# EAGLE design Massage_Pad_Main (EAGLE 9.3.1)
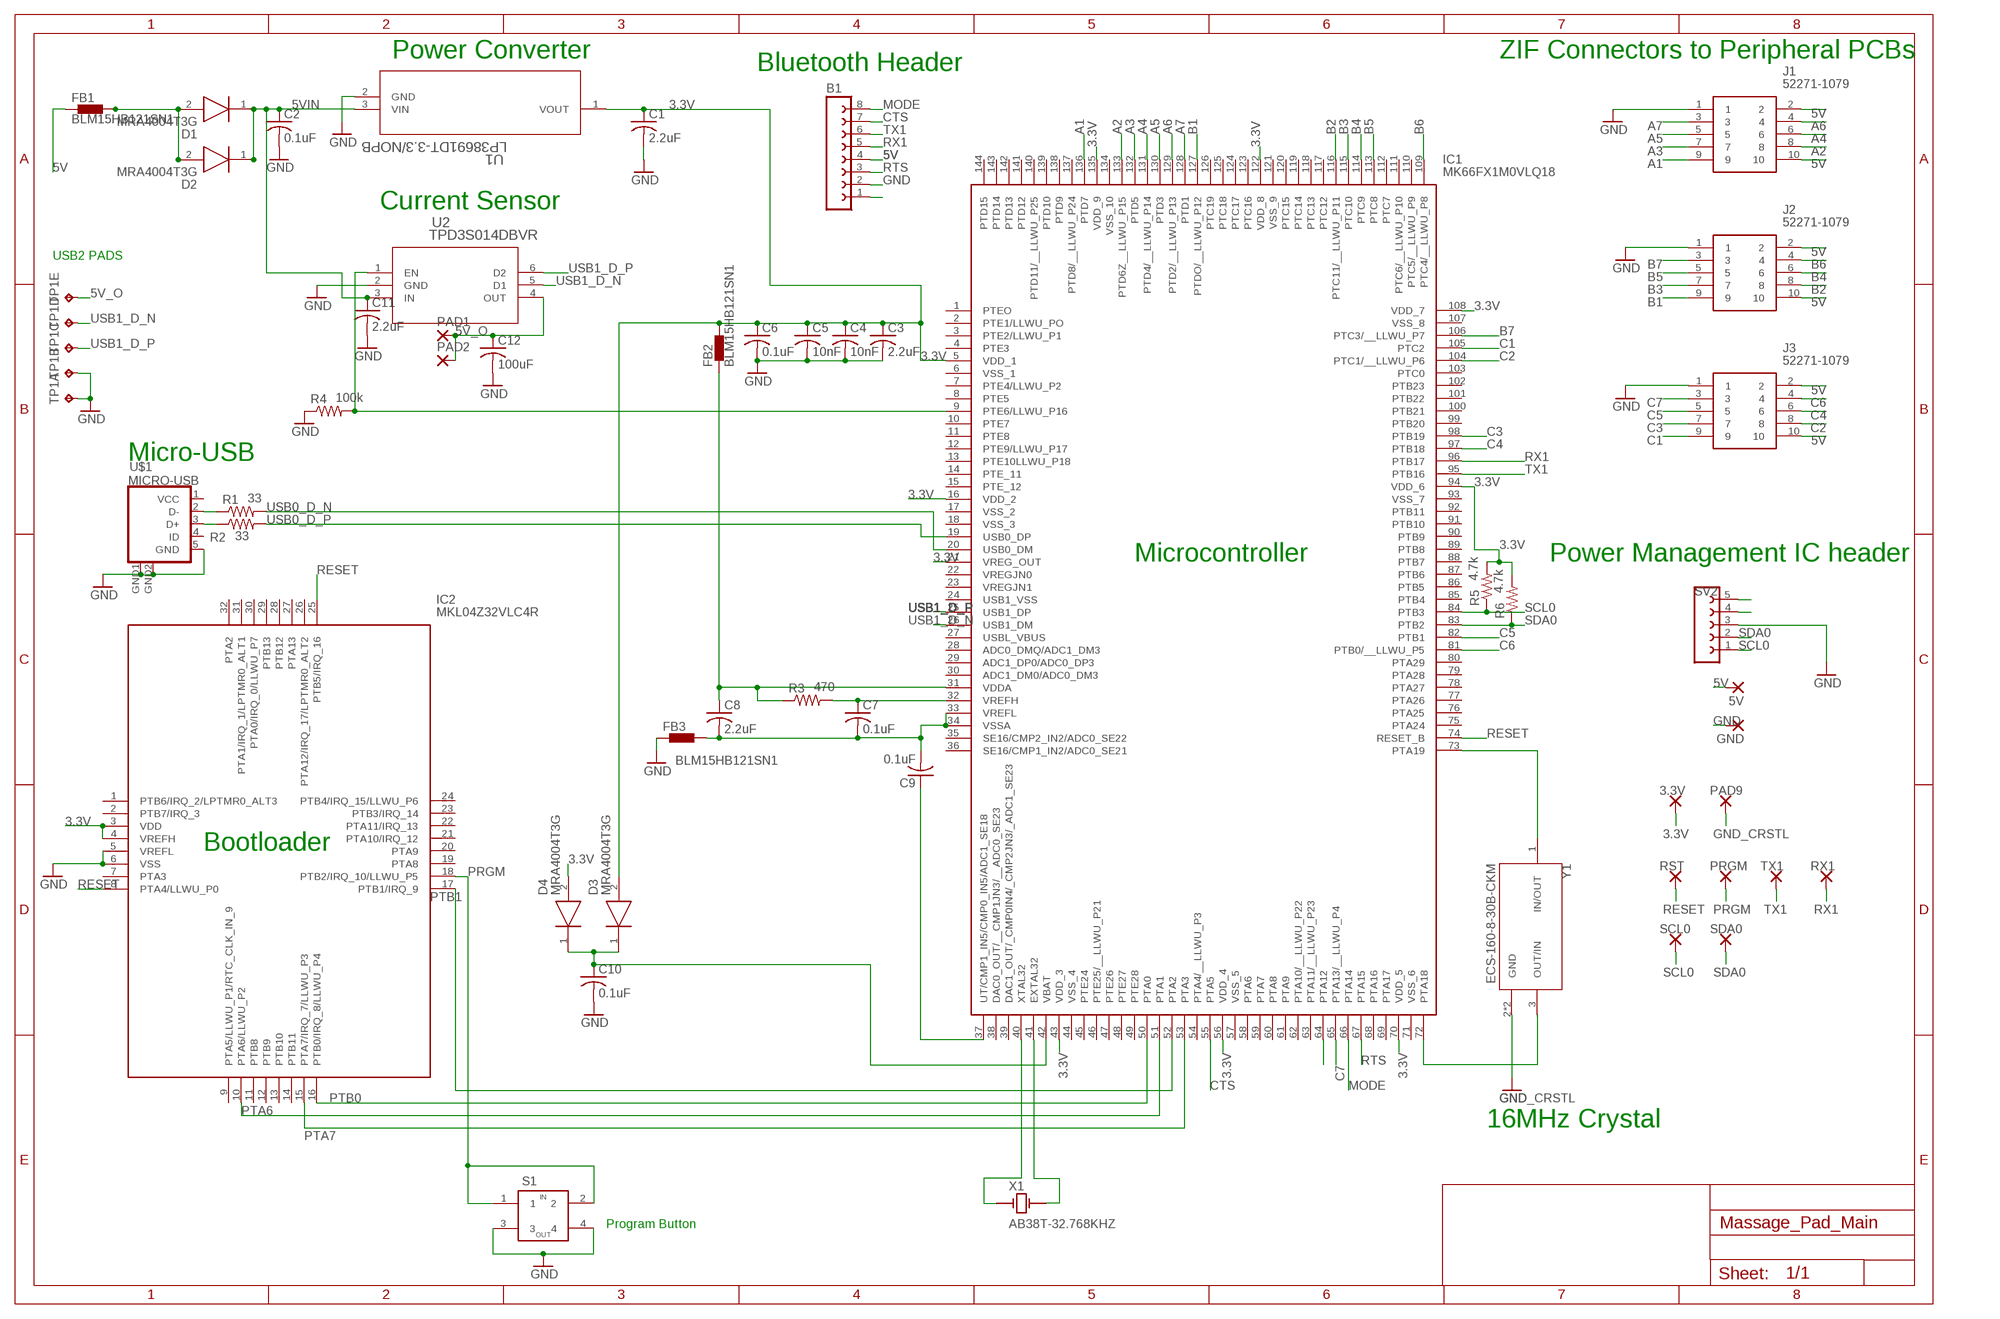
[diagram p0: schematic, sheet 1]

## Parts
3.3V  1,6/0,8  [1,6/0,8]
5V  3,17/1,3  [3,17/1,3]
B1  BT-BLE-2479  [BT-BLE-2479]
C1  2.2uF  C-USC1812K  [C1812K]
C2  0.1uF  C-USC1808  [C1808]
C3  2.2uF  C-USC1812K  [C1812K]
C4  10nF  C-USC1808  [C1808]
C5  10nF  C-USC1808  [C1808]
C6  0.1uF  C-USC1808  [C1808]
C7  0.1uF  C-USC1808  [C1808]
C8  2.2uF  C-USC1812K  [C1812K]
C9  0.1uF  C-USC1808  [C1808]
C10  0.1uF  C-USC1808  [C1808]
C11  2.2uF  C-USC1812K  [C1812K]
C12  100uF  C-USC1210K  [C1210K]
D1  MRA4004T3G  [DIOM5226X220N]
D2  MRA4004T3G  [DIOM5226X220N]
D3  MRA4004T3G  [DIOM5226X220N]
D4  MRA4004T3G  [DIOM5226X220N]
FB1  BLM15HB121SN1  [0402]
FB2  BLM15HB121SN1  [0402]
FB3  BLM15HB121SN1  [0402]
GND  3,17/1,3  [3,17/1,3]
IC1  MK66FX1M0VLQ18  [QFP50P2200X2200X160-144N]
IC2  MKL04Z32VLC4R  [QFP80P900X900X160-32N]
J1  52271-1079  [52271-1079]
J2  52271-1079  [52271-1079]
J3  52271-1079  [52271-1079]
PAD1  SMD5  [SMD2,54-5,08]
PAD2  SMD5  [SMD2,54-5,08]
PAD9  1,6/0,8  [1,6/0,8]
PRGM  1,6/0,8  [1,6/0,8]
R1  33  R-US_R1206  [R1206]
R2  33  R-US_R1206  [R1206]
R3  470  R-US_R1206  [R1206]
R4  100k  R-US_R1206  [R1206]
R5  4.7k  R-US_R1206  [R1206]
R6  4.7k  R-US_R1206  [R1206]
RST  1,6/0,8  [1,6/0,8]
RX1  1,6/0,8  [1,6/0,8]
S1  RS-187R05A2-DSMTRT  [RS-187R05A2-DSMTRT]
SCL0  1,6/0,8  [1,6/0,8]
SDA0  1,6/0,8  [1,6/0,8]
SV2  FE05-1  [FE05-1]
TP1  TP5P5-25-13  [P5-25-13]
TX1  1,6/0,8  [1,6/0,8]
U1  LP38691DT-3.3/NOPB  [TD03B]
U2  TPD3S014DBVR  [DBV6]
U$1  MICRO-USB  [MICRO-USB]
X1  AB38T-32.768KHZ  [XTAL_AB38T-32.768KHZ]
Y1  ECS-160-8-30B-CKM  [XTAL_ECS-160-8-30B-CKM]

## Nets
3.3V: 3.3V.1(P) C1.1 C3.1 C4.1 C5.1 C6.1 D3.2(A) D4.2(A) FB2.2 IC1.5(VDD_1) IC1.16(VDD_2) IC1.21(VREG_OUT) IC1.43(VDD_3) IC1.56(VDD_4) IC1.70(VDD_5) IC1.94(VDD_6) IC1.108(VDD_7) IC1.122(VDD_8) IC1.135(VDD_9) IC2.3(VDD) IC2.4(VREFH) R5.2 R6.2 U1.1(VOUT)
5V: 5V.1(P) B1.4 FB1.1 J1.2 J1.10 J2.2 J2.10 J3.2 J3.10
5V_O: C12.1 PAD1.1(P) PAD2.1(P) TP1.TP-5 U2.4(OUT)
5VIN: C2.1 C11.1 D1.1(K) D2.1(K) U1.3(VIN) U2.3(IN)
A1: IC1.136(PTD7) J1.9
A2: IC1.133(PTD6Z__LLWU_P15) J1.8
A3: IC1.132(PTD5) J1.7
A4: IC1.131(PTD4/__LLWU_P14) J1.6
A5: IC1.130(PTD3) J1.5
A6: IC1.129(PTD2/__LLWU_P13) J1.4
A7: IC1.128(PTD1) J1.3
B1: IC1.127(PTDO/__LLWU_P12) J2.9
B2: IC1.116(PTC11/__LLWU_P11) J2.8
B3: IC1.115(PTC10) J2.7
B4: IC1.114(PTC9) J2.6
B5: IC1.113(PTC8) J2.5
B6: IC1.109(PTC4/__LLWU_P8) J2.4
B7: IC1.106(PTC3/__LLWU_P7) J2.3
C1: IC1.105(PTC2) J3.9
C2: IC1.104(PTC1/__LLWU_P6) J3.8
C3: IC1.98(PTB19) J3.7
C4: IC1.97(PTB18) J3.6
C5: IC1.82(PTB1) J3.5
C6: IC1.81(PTB0/__LLWU_P5) J3.4
C7: IC1.65(PTA13/__LLWU_P4) J3.3
CTS: B1.7 IC1.55(PTA5)
DFU_5V: B1.1
GND: B1.2 C1.2 C2.2 C3.2 C4.2 C5.2 C6.2 C10.2 C11.2 C12.2 FB3.1 GND.1(P) IC2.5(VREFL) IC2.6(VSS) J1.1 J2.1 J3.1 R4.1 S1.3 S1.4 SV2.3 TP1.TP-1 TP1.TP-2 U1.2(GND) U2.2(GND) U$1.5(GND) U$1.GND1(GND) U$1.GND2(GND)
GND_CRSTL: PAD9.1(P) Y1.2(GND) Y1.4(GND) ; supply symbol labelled GND
MODE: B1.8 IC1.66(PTA14)
N$5: C10.1 D3.1(K) D4.1(K) IC1.42(VBAT)
N$8 [usb diff]: R1.1 U$1.2(D-)
N$10 [usb diff]: R2.1 U$1.3(D+)
N$21: D1.2(A) D2.2(A) FB1.2
N$22: IC1.64(PTA12)
N$23: IC1.73(PTA19) Y1.1(IN/OUT)
N$24: C7.1 IC1.32(VREFH) R3.2
N$26: C7.2 C8.2 C9.2 FB3.2 IC1.33(VREFL) IC1.34(VSSA)
N$27: C8.1 FB2.1 IC1.31(VDDA) R3.1
N$28: C9.1 IC1.37(UT/CMP1_IN5/CMP0_IN5/ADC1_SE18)
N$29: IC1.72(PTA18) Y1.3(OUT/IN)
N$30: IC1.40(XTAL32) X1.1
N$31: IC1.41(EXTAL32) X1.2
N$32: SV2.5
N$33: SV2.4
N$34: IC1.9(PTE6/LLWU_P16) R4.2 U2.1(EN)
PRGM: IC2.18(PTB2/IRQ_10/LLWU_P5) PRGM.1(P) S1.1 S1.2
PTA6: IC1.51(PTA1) IC2.10(PTA6/LLWU_P2)
PTA7: IC1.53(PTA3) IC2.15(PTA7/IRQ_7/LLWU_P3)
PTB0: IC1.50(PTA0) IC2.16(PTB0/IRQ_8/LLWU_P4)
PTB1: IC1.52(PTA2) IC2.17(PTB1/IRQ_9)
RESET: IC1.74(RESET_B) IC2.8(PTA4/LLWU_P0) IC2.25(PTB5/IRQ_16) RST.1(P)
RTS: B1.3 IC1.67(PTA15)
RX1: B1.5 IC1.96(PTB17) RX1.1(P)
SCL0: IC1.84(PTB3) R5.1 SCL0.1(P) SV2.1
SDA0: IC1.83(PTB2) R6.1 SDA0.1(P) SV2.2
TX1: B1.6 IC1.95(PTB16) TX1.1(P)
USB0_D_N [usb diff]: IC1.20(USB0_DM) R1.2
USB0_D_P [usb diff]: IC1.19(USB0_DP) R2.2
USB1_D_N [usb diff]: IC1.26(USB1_DM) TP1.TP-4 U2.5(D1)
USB1_D_P [usb diff]: IC1.25(USB1_DP) TP1.TP-3 U2.6(D2)
Unconnected: IC1.1(PTEO) IC1.2(PTE1/LLWU_PO) IC1.3(PTE2/LLWU_P1) IC1.4(PTE3) IC1.6(VSS_1) IC1.7(PTE4/LLWU_P2) IC1.8(PTE5) IC1.10(PTE7) IC1.11(PTE8) IC1.12(PTE9/LLWU_P17) IC1.13(PTE10LLWU_P18) IC1.14(PTE_11) IC1.15(PTE_12) IC1.17(VSS_2) IC1.18(VSS_3) IC1.22(VREGJN0) IC1.23(VREGJN1) IC1.24(USB1_VSS) IC1.27(USBL_VBUS) IC1.28(ADC0_DMQ/ADC1_DM3) IC1.29(ADC1_DP0/ADC0_DP3) IC1.30(ADC1_DM0/ADC0_DM3) IC1.35(SE16/CMP2_IN2/ADC0_SE22) IC1.36(SE16/CMP1_IN2/ADC0_SE21) IC1.38(DAC0_OUT/__CMP1JN3/__ADC0_SE23) IC1.39(DAC1_OUT/_CMP0IN4/_CMP2JN3/_ADC1_SE23) IC1.44(VSS_4) IC1.45(PTE24) IC1.46(PTE25/__LLWU_P21) IC1.47(PTE26) IC1.48(PTE27) IC1.49(PTE28) IC1.54(PTA4/__LLWU_P3) IC1.57(VSS_5) IC1.58(PTA6) IC1.59(PTA7) IC1.60(PTA8) IC1.61(PTA9) IC1.62(PTA10/__LLWU_P22) IC1.63(PTA11/__LLWU_P23) IC1.68(PTA16) IC1.69(PTA17) IC1.71(VSS_6) IC1.75(PTA24) IC1.76(PTA25) IC1.77(PTA26) IC1.78(PTA27) IC1.79(PTA28) IC1.80(PTA29) IC1.85(PTB4) IC1.86(PTB5) IC1.87(PTB6) IC1.88(PTB7) IC1.89(PTB8) IC1.90(PTB9) IC1.91(PTB10) IC1.92(PTB11) IC1.93(VSS_7) IC1.99(PTB20) IC1.100(PTB21) IC1.101(PTB22) IC1.102(PTB23) IC1.103(PTC0) IC1.107(VSS_8) IC1.110(PTC5/__LLWU_P9) IC1.111(PTC6/__LLWU_P10) IC1.112(PTC7) IC1.117(PTC12) IC1.118(PTC13) IC1.119(PTC14) IC1.120(PTC15) IC1.121(VSS_9) IC1.123(PTC16) IC1.124(PTC17) IC1.125(PTC18) IC1.126(PTC19) IC1.134(VSS_10) IC1.137(PTD8/__LLWU_P24) IC1.138(PTD9) IC1.139(PTD10) IC1.140(PTD11/__LLWU_P25) IC1.141(PTD12) IC1.142(PTD13) IC1.143(PTD14) IC1.144(PTD15) IC2.1(PTB6/IRQ_2/LPTMR0_ALT3) IC2.2(PTB7/IRQ_3) IC2.7(PTA3) IC2.9(PTA5/LLWU_P1/RTC_CLK_IN_9) IC2.11(PTB8) IC2.12(PTB9) IC2.13(PTB10) IC2.14(PTB11) IC2.19(PTA8) IC2.20(PTA9) IC2.21(PTA10/IRQ_12) IC2.22(PTA11/IRQ_13) IC2.23(PTB3/IRQ_14) IC2.24(PTB4/IRQ_15/LLWU_P6) IC2.26(PTA12/IRQ_17/LPTMR0_ALT2) IC2.27(PTA13) IC2.28(PTB12) IC2.29(PTB13) IC2.30(PTA0/IRQ_0/LLWU_P7) IC2.31(PTA1/IRQ_1/LPTMR0_ALT1) IC2.32(PTA2) U$1.4(ID)

## Notes on the sheet
- Power Converter | ZIF Connectors to Peripheral PCBs
- Bluetooth Header
- Current Sensor
- USB2 PADS
- Micro-USB
- Microcontroller | Power Management IC header
- Bootloader
- 16MHz Crystal
- Program Button

## Power pins joined to a net without a drawn wire
VCC: U$1.1(VCC)

## Library data of the parts
3.3V PAD9 PRGM RST RX1 SCL0 SDA0 TX1 = wirepad:1,6/0,8: THROUGH-HOLE PAD
5V GND = wirepad:3,17/1,3: THROUGH-HOLE PAD
B1 = altair_mainPCB_custom_lib:BT-BLE-2479: Adafruit bluetooth BLE module for mounting onto PCB. Has female headers for mating with the BLE board.
C1-C12 = rcl:C-US: CAPACITOR, American symbol; SPICEPREFIX: C
D1-D4 = MRA4004T3G:MRA4004T3G: Rectifier diode,MRA4004 1A 400V ON Semi MRA4004T3G, SMT Switching Diode, 400V 1A, 2-Pin DO-214AC Source: Datasheet <http://www.onsemi.com/pub/Collateral/MRA4003T3-D.PDF>; ALLIED_NUMBER: 70340468; ALLIED_PRICE-STOCK: http://www.alliedelec.com/on-semiconductor-mra4004t3g/70340468/; DESCRIPTION: Rectifier diode,MRA4004 1A 400V ON Semi MRA4004T3G, SMT Switching Diode, 400V 1A, 2-Pin DO-214AC; HEIGHT: 2.2mm; MANUFACTURER_NAME: ON Semiconductor; MANUFACTURER_PART_NUMBER: MRA4004T3G; MOUSER_PART_NUMBER: 863-MRA4004T3G; MOUSER_PRICE-STOCK: https://www.mouser.com/Search/Refine.aspx?Keyword=863-MRA4004T3G; RS_PART_NUMBER: 6490904; RS_PRICE-STOCK: http://uk.rs-online.com/web/p/products/6490904
FB1-FB3 = inductors:BLM15H: EMIFIL (R) Chip Ferrite Bead for GHz Noise Source: http://www.murata.com/ Ferrite Bead BLM15H.pdf
IC1 = MK66FX1M0VLQ18:MK66FX1M0VLQ18: NXP - MK66FX1M0VLQ18 - MPU, ARM CORTEX-M4F, 180MHZ, LQFP-144 Source: Datasheet <https://cache.nxp.com/docs/en/data-sheet/K66P144M180SF5V2.pdf>; DESCRIPTION: NXP - MK66FX1M0VLQ18 - MPU, ARM CORTEX-M4F, 180MHZ, LQFP-144; HEIGHT: 1.6mm; MANUFACTURER_NAME: Nexperia; MANUFACTURER_PART_NUMBER: MK66FX1M0VLQ18; MOUSER_PART_NUMBER: 841-MK66FX1M0VLQ18; MOUSER_PRICE-STOCK: https://www.mouser.com/Search/Refine.aspx?Keyword=841-MK66FX1M0VLQ18
IC2 = MKL04Z32VLC4R:MKL04Z32VLC4R: IC MCU 32BIT 32KB FLASH 32LQFP Source: Datasheet <http://cache.freescale.com/files/32bit/doc/data_sheet/KL04P48M48SF1.pdf>; DESCRIPTION: IC MCU 32BIT 32KB FLASH 32LQFP; HEIGHT: 1.6mm; MANUFACTURER_NAME: Nexperia; MANUFACTURER_PART_NUMBER: MKL04Z32VLC4R; MOUSER_PART_NUMBER: N/A; MOUSER_PRICE-STOCK: https://www.mouser.com/Search/Refine.aspx?Keyword=N%2FA
J1-J3 = 52271-1079:52271-1079: 1.0MM FPC R/A CONN 10 W Molex FFC/FPC SMT Series 1mm Pitch 10 Way Right Angle SMT Female FPC Connector, ZIF Bottom Contact Source: Datasheet <http://www.molex.com/webdocs/datasheets/pdf/en-us//0522711079_FFC_FPC_CONNECTORS.pdf>; ALLIED_NUMBER: 70373119; ALLIED_PRICE-STOCK: https://www.alliedelec.com/molex-incorporated-52271-1079/70373119/; DESCRIPTION: 1.0MM FPC R/A CONN 10 W Molex FFC/FPC SMT Series 1mm Pitch 10 Way Right Angle SMT Female FPC Connector, ZIF Bottom Contact; HEIGHT: mm; MANUFACTURER_NAME: Molex; MANUFACTURER_PART_NUMBER: 52271-1079; MOUSER_PART_NUMBER: 538-52271-1079; MOUSER_PRICE-STOCK: https://www.mouser.com/Search/Refine.aspx?Keyword=538-52271-1079; RS_PART_NUMBER: 5144329P; RS_PRICE-STOCK: http://uk.rs-online.com/web/p/products/5144329P
PAD1 PAD2 = wirepad:SMD5: SMD PAD
R1-R6 = resistor:R-US_: RESISTOR, American symbol
S1 = altair_mainPCB_custom_lib:RS-187R05A2-DSMTRT: Tactile Switch SPST-NO Top Actuated Surface Mount, 0.05A 12V, Off-Mom https://www.digikey.com/product-detail/en/c-k/RS-187R05A2-DS-MT-RT/CKN10361CT-ND/2747199
SV2 = con-lsta:FE05-1: FEMALE HEADER; OC_FARNELL: unknown; OC_NEWARK: unknown
TP1 = testpad:TP5: Test pad
U1 = lp38691DT-3.3:NOPB:LP38691DT-3.3/NOPB; MANUFACTURER_PART_NUMBER: LP38691DT3.3NOPB; VENDOR: Texas Instruments
U2 = TPD3s014DBVR:TPD3S014DBVR; MANUFACTURER_PART_NUMBER: TPD3S014DBVR; VENDOR: Texas Instruments
U$1 = microusb:MICRO-USB: Micro USB B connector
X1 = AB38T-32.768KHZ:AB38T-32.768KHZ: AB38T Series 32.768 kHz ±20 ppm 12.5 pF -10 to +60 °C Tuning Fork Crystal; DESCRIPTION: AB38T Series 32.768 kHz ±20 ppm 12.5 pF -10 to +60 °C Tuning Fork Crystal; DIGI-KEY_PART_NUMBER: 535-9034-ND; DIGI-KEY_PURCHASE_URL: https://www.digikey.com/product-detail/en/abracon-llc/AB38T-32.768KHZ/535-9034-ND/675229?utm_source=snapeda&utm_medium=aggregator&utm_campaign=symbol; MF: Abracon; MP: AB38T-32.768KHZ; PACKAGE: Cylindrical Can Radial Abracon
Y1 = ECS-160-8-30B-CKM:ECS-160-8-30B-CKM: The ECX-53B is a miniature SMD Crystal with a 3.2 x 5 mm footprint. This package is ideal for todays compact wireless applications where board space is critical.; DESCRIPTION: Crystal 16.0000mhz 8pf Smd; DIGI-KEY_PART_NUMBER: XC1839CT-ND; DIGI-KEY_PURCHASE_URL: https://www.digikey.com/product-detail/en/ecs-inc/ECS-160-8-30B-CKM/XC1839CT-ND/2781964?utm_source=snapeda&utm_medium=aggregator&utm_campaign=symbol; MF: ECS Inc.; MP: ECS-160-8-30B-CKM; PACKAGE: SMD-4 ECS International

## Net classes
1 usb diff: width 0.292 mm, drill 0.33 mm, clearance 0.127 mm
2 top grnd pour: clearance 0.762 mm to class 1

## Board
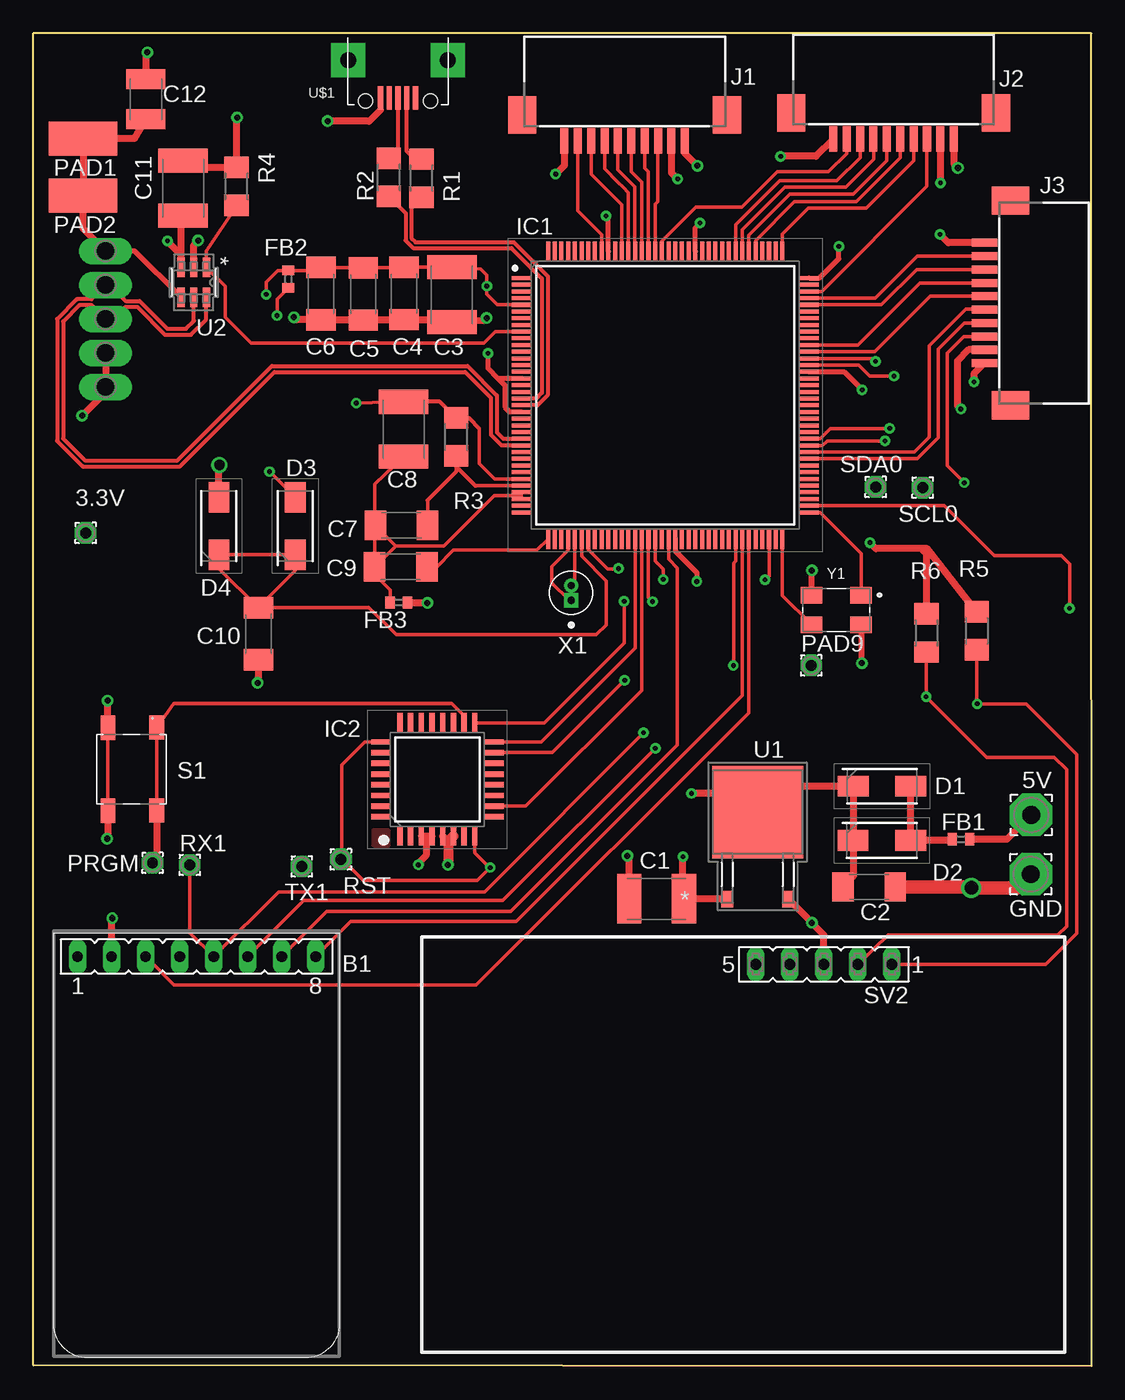
[diagram p1: board, top side]
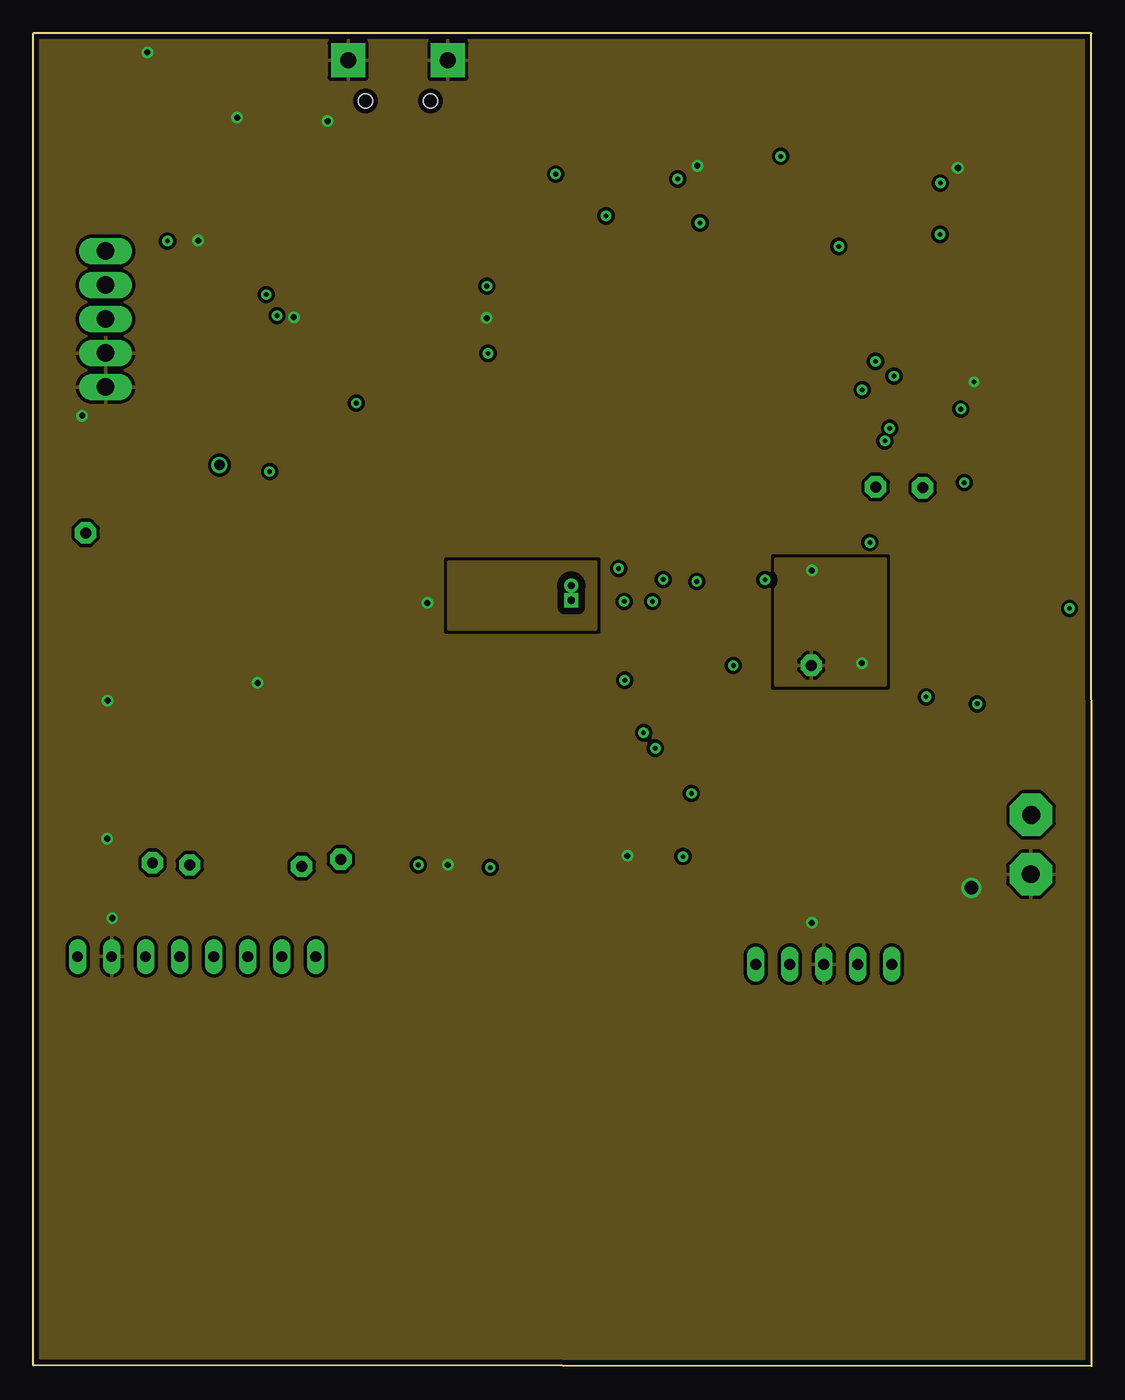
[diagram p2: board, inner layer Route2]
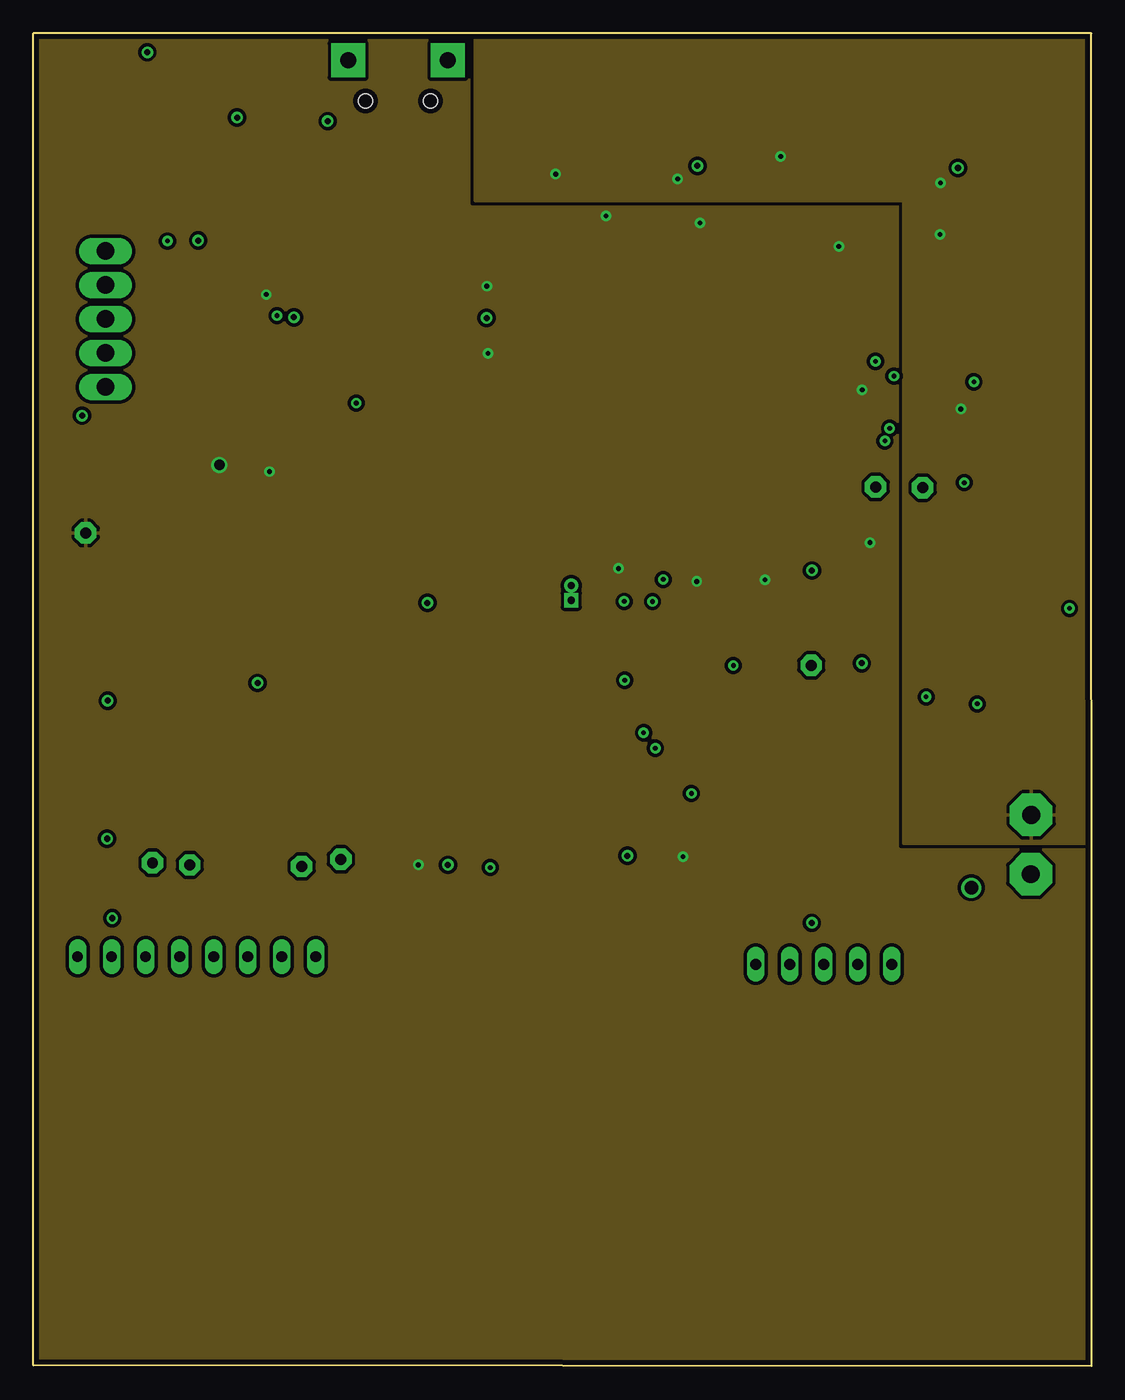
[diagram p3: board, inner layer Route15]
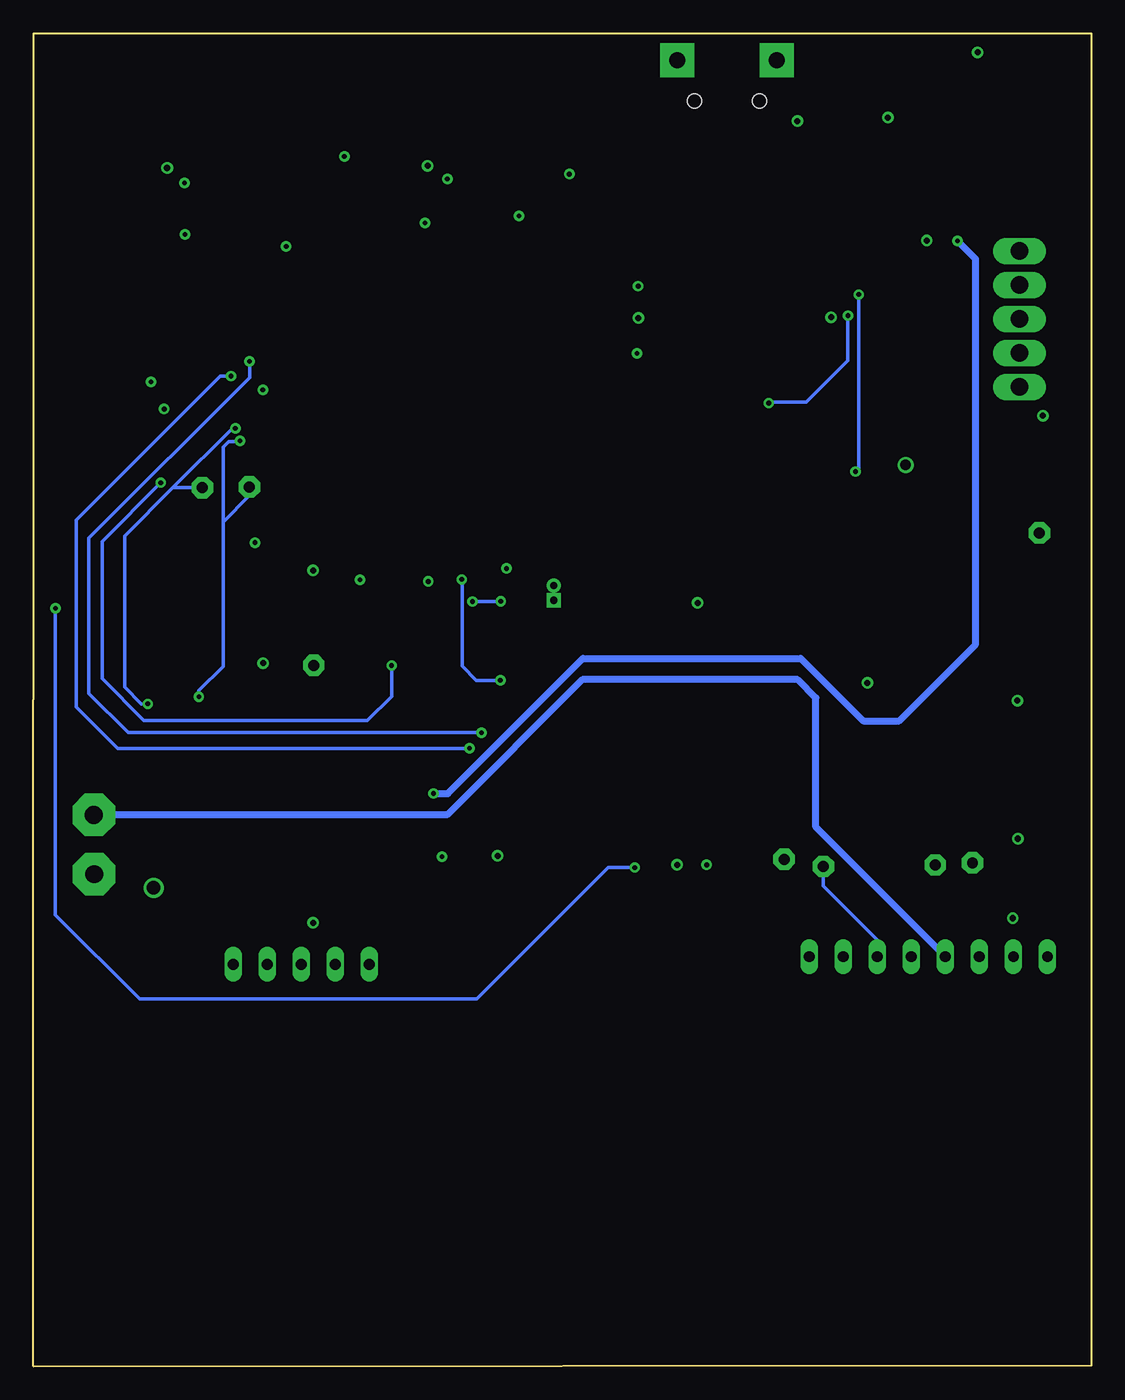
[diagram p4: board, bottom side, seen from below]

Size 79.02 x 99.55 mm. Coordinates in mm from the lower left corner, seen from the top.
Outline: 0,99.55 79,99.55 79.02,0 0,0.05 0,99.55
Outline: 0,99.55 0,99.55
Copper layers (1+2*15+16): Top 0.01778125mm / dielectric 0.23368125mm / Route2 0.01778125mm / dielectric 0.23368125mm / Route15 0.01778125mm / dielectric 0.23368125mm / Bottom 0.01778125mm
Design rules "default *": minimum track width 5mil, minimum drill 0.35mm, track to track 6mil, track to pad 6mil, pad to pad 6mil, via to via 6mil, smd to smd 6mil, copper to edge 15mil, drill to drill 6mil, minimum pad ring 10mil, minimum via ring 8mil, stop-mask expansion 4mil, vias tented up to drill 0mil, thermal gap 10mil

### Footprints (pad centres in the part's own frame; a part is rotated, then mirrored left to right if it is on the bottom)
1,6/0,8 = drill 0.813 pad 1.6 octagon: 1 0,0
3,17/1,3 = drill 1.321 pad 3.175 octagon: 1 0,0
BT-BLE-2479 = drill 0.813 long: 1 8.89,-13.97; 2 6.35,-13.97; 3 3.81,-13.97; 4 1.27,-13.97; 5 -1.27,-13.97; 6 -3.81,-13.97; 7 -6.35,-13.97; 8 -8.89,-13.97
C1812K = smd 1.8 x 3.7: 1 -2.05,0; 2 2.05,0
C1808 = smd 1.6 x 2.2: 1 -1.95,0; 2 1.95,0
C1210K = smd 1.5 x 2.9: 1 -1.5,0; 2 1.5,0
DIOM5226X220N = smd 2.3 x 1.55: 1 -2.15,0; 2 2.15,0
0402 = smd 0.7 x 0.9: 1 -0.65,0; 2 0.65,0
QFP50P2200X2200X160-144N = smd 1.475 x 0.3: 1 -10.738,8.75; 2 -10.738,8.25; 3 -10.738,7.75; 4 -10.738,7.25; 5 -10.738,6.75; 6 -10.738,6.25; 7 -10.738,5.75; 8 -10.738,5.25; 9 -10.738,4.75; 10 -10.738,4.25; 11 -10.738,3.75; 12 -10.738,3.25; 13 -10.738,2.75; 14 -10.738,2.25; 15 -10.738,1.75; 16 -10.738,1.25; 17 -10.738,0.75; 18 -10.738,0.25; 19 -10.738,-0.25; 20 -10.738,-0.75; 21 -10.738,-1.25; 22 -10.738,-1.75; 23 -10.738,-2.25; 24 -10.738,-2.75; 25 -10.738,-3.25; 26 -10.738,-3.75; 27 -10.738,-4.25; 28 -10.738,-4.75; 29 -10.738,-5.25; 30 -10.738,-5.75; 31 -10.738,-6.25; 32 -10.738,-6.75; 33 -10.738,-7.25; 34 -10.738,-7.75; 35 -10.738,-8.25; 36 -10.738,-8.75; 73 10.738,-8.75; 74 10.738,-8.25; 75 10.738,-7.75; 76 10.738,-7.25; 77 10.738,-6.75; 78 10.738,-6.25; 79 10.738,-5.75; 80 10.738,-5.25; 81 10.738,-4.75; 82 10.738,-4.25; 83 10.738,-3.75; 84 10.738,-3.25; 85 10.738,-2.75; 86 10.738,-2.25; 87 10.738,-1.75; 88 10.738,-1.25; 89 10.738,-0.75; 90 10.738,-0.25; 91 10.738,0.25; 92 10.738,0.75; 93 10.738,1.25; 94 10.738,1.75; 95 10.738,2.25; 96 10.738,2.75; 97 10.738,3.25; 98 10.738,3.75; 99 10.738,4.25; 100 10.738,4.75; 101 10.738,5.25; 102 10.738,5.75; 103 10.738,6.25; 104 10.738,6.75; 105 10.738,7.25; 106 10.738,7.75; 107 10.738,8.25; 108 10.738,8.75 | smd 0.3 x 1.475: 37 -8.75,-10.738; 38 -8.25,-10.738; 39 -7.75,-10.738; 40 -7.25,-10.738; 41 -6.75,-10.738; 42 -6.25,-10.738; 43 -5.75,-10.738; 44 -5.25,-10.738; 45 -4.75,-10.738; 46 -4.25,-10.738; 47 -3.75,-10.738; 48 -3.25,-10.738; 49 -2.75,-10.738; 50 -2.25,-10.738; 51 -1.75,-10.738; 52 -1.25,-10.738; 53 -0.75,-10.738; 54 -0.25,-10.738; 55 0.25,-10.738; 56 0.75,-10.738; 57 1.25,-10.738; 58 1.75,-10.738; 59 2.25,-10.738; 60 2.75,-10.738; 61 3.25,-10.738; 62 3.75,-10.738; 63 4.25,-10.738; 64 4.75,-10.738; 65 5.25,-10.738; 66 5.75,-10.738; 67 6.25,-10.738; 68 6.75,-10.738; 69 7.25,-10.738; 70 7.75,-10.738; 71 8.25,-10.738; 72 8.75,-10.738; 109 8.75,10.738; 110 8.25,10.738; 111 7.75,10.738; 112 7.25,10.738; 113 6.75,10.738; 114 6.25,10.738; 115 5.75,10.738; 116 5.25,10.738; 117 4.75,10.738; 118 4.25,10.738; 119 3.75,10.738; 120 3.25,10.738; 121 2.75,10.738; 122 2.25,10.738; 123 1.75,10.738; 124 1.25,10.738; 125 0.75,10.738; 126 0.25,10.738; 127 -0.25,10.738; 128 -0.75,10.738; 129 -1.25,10.738; 130 -1.75,10.738; 131 -2.25,10.738; 132 -2.75,10.738; 133 -3.25,10.738; 134 -3.75,10.738; 135 -4.25,10.738; 136 -4.75,10.738; 137 -5.25,10.738; 138 -5.75,10.738; 139 -6.25,10.738; 140 -6.75,10.738; 141 -7.25,10.738; 142 -7.75,10.738; 143 -8.25,10.738; 144 -8.75,10.738
QFP80P900X900X160-32N = smd 1.45 x 0.4: 1 -4.225,2.8; 2 -4.225,2; 3 -4.225,1.2; 4 -4.225,0.4; 5 -4.225,-0.4; 6 -4.225,-1.2; 7 -4.225,-2; 8 -4.225,-2.8; 17 4.225,-2.8; 18 4.225,-2; 19 4.225,-1.2; 20 4.225,-0.4; 21 4.225,0.4; 22 4.225,1.2; 23 4.225,2; 24 4.225,2.8 | smd 0.4 x 1.45: 9 -2.8,-4.225; 10 -2,-4.225; 11 -1.2,-4.225; 12 -0.4,-4.225; 13 0.4,-4.225; 14 1.2,-4.225; 15 2,-4.225; 16 2.8,-4.225; 25 2.8,4.225; 26 2,4.225; 27 1.2,4.225; 28 0.4,4.225; 29 -0.4,4.225; 30 -1.2,4.225; 31 -2,4.225; 32 -2.8,4.225
52271-1079 = smd 0.6 x 1.9: 1 -4.5,1.1; 2 -3.5,1.1; 3 -2.5,1.1; 4 -1.5,1.1; 5 -0.5,1.1; 6 0.5,1.1; 7 1.5,1.1; 8 2.5,1.1; 9 3.5,1.1; 10 4.5,1.1 | smd 2.1 x 2.8: 11 7.65,-0.85; 12 -7.65,-0.85
SMD2,54-5,08 = smd 2.54 x 5.08: 1 0,0
R1206 = smd 1.6 x 1.803: 1 -1.422,0; 2 1.422,0
RS-187R05A2-DSMTRT = smd 1.8 x 1.1: 1 -3.125,1.883; 2 3.075,1.883; 3 -3.1,-1.756; 4 3.1,-1.756
FE05-1 = drill 0.813 long: 1 -5.08,0; 2 -2.54,0; 3 0,0; 4 2.54,0; 5 5.08,0
P5-25-13 = drill 1.321 pad 1.905 long: TP-1 -5.08,0; TP-2 -2.54,0; TP-3 0,0; TP-4 2.54,0; TP-5 5.08,0
TD03B = smd 0.889 x 1.219: 1 -2.285,-6.502; 2 2.285,-6.502 | smd 6.782 x 6.909: 3 0,0
DBV6 = smd 1.473 x 0.559: 1 -1.118,0.95; 2 -1.118,0; 3 -1.118,-0.95; 4 1.118,-0.95; 5 1.118,0; 6 1.118,0.95
MICRO-USB = smd 0.4 x 1.75: 1 -1.3,4.525; 2 -0.65,4.525; 3 0,4.525; 4 0.65,4.525; 5 1.3,4.525 | drill 1.2 pad 2.54 square: GND1 -3.725,1.7; GND2 3.725,1.7 | hole 1.05: -2.425,4.73; 2.425,4.73
XTAL_AB38T-32.768KHZ = drill 0.55 pad 0.925 square: 1 -0.55,0 | drill 0.55 pad 0.925: 2 0.55,0
XTAL_ECS-160-8-30B-CKM = smd 1.6 x 1.25: 1 -1.85,-1.1; 2 1.85,-1.1; 3 1.85,1.1; 4 -1.85,1.1

### Placement (x,y rotation side)
3.3V  3.89,62.24 0 top
5V  74.51,41.17 0 top
B1  12.18,16.62 180 top
C1  46.53,34.9 180 top
C2  62.41,35.79 0 top
C3  31.24,80.04 270 top
C4  27.67,80.12 270 top
C5  24.63,80.09 270 top
C6  21.47,80.11 270 top
C7  27.48,62.81 180 top
C8  27.64,69.98 270 top
C9  27.43,59.71 180 top
C10  16.79,54.71 270 top
C11  11.18,87.99 90 top
C12  8.39,94.64 90 top
D1  63.37,43.32 0 top
D2  63.36,39.26 0 top
D3  19.55,62.76 90 top
D4  13.85,62.76 90 top
FB1  69.27,39.36 180 top
FB2  19.04,81.19 90 top
FB3  27.28,57.04 180 top
GND  74.48,36.74 0 top
IC1  47.18,72.53 0 top
IC2  30.16,43.83 90 top
J1  44.15,92.62 180 top
J2  64.23,92.77 180 top
J3  72.11,79.42 90 top
PAD1  3.7,91.69 90 top
PAD2  3.7,87.42 90 top
PAD9  58.08,52.35 0 top
PRGM  8.89,37.6 0 top
R1  28.98,88.74 270 top
R2  26.54,88.8 270 top
R3  31.56,69.42 270 top
R4  15.17,88.13 270 top
R5  70.45,54.93 90 top
R6  66.69,54.77 90 top
RST  22.95,37.86 0 top
RX1  11.67,37.44 0 top
S1  7.32,44.59 270 top
SCL0  66.4,65.61 0 top
SDA0  62.89,65.68 0 top
SV2  59.03,30.02 180 top
TP1  5.39,78.22 90 top
TX1  20.03,37.32 0 top
U1  54.09,41.39 0 top
U2  11.97,80.96 270 top
U$1  27.22,99.25 180 top
X1  40.16,57.76 90 top
Y1  59.96,56.48 180 top

### Tracks (layer width: path | path; a pad name or v marks a point on that pad's centre or on a via)
3.3V  (via drill 0.35, 0.35 pad 0.78, 0.78 pad 0.78)
  Top 0.254: 48.5,34.88 C1.1 | v17.63,66.83 D3.2 | v33.86,80.67 33.86,81.5 33.42,81.94 C3.1 28.3,82.09 C4.1 24.67,82.07 C5.1 24.6,82.06 C6.1 21.24,81.84 FB2.2 18.25,81.84 17.38,80.97 v17.38,80.05 | v33.86,80.67 33.86,80.06 34.64,79.28 IC1.5 | v33.86,80.67 | 42.93,85.75 v42.76,85.92 | 49.43,85.05 v49.77,85.4 | IC1.43 41.43,60.99 42.87,59.55 43.67,59.55 v43.7,59.58 | IC1.70 54.93,59.03 v54.63,58.73
  Top 0.381: IC1.135 42.93,85.75 | IC1.122 49.43,85.05 | IC1.108 58.7,81.28 60.15,82.72 v60.15,83.65 | IC1.94 60.55,74.28 v61.89,72.93 | IC1.56 47.93,60.87 49.53,59.27 v49.53,58.61 | IC1.21 35.56,71.28 35.24,71.61 35.24,73.24 34.71,73.78 | 34.71,73.78 33.95,74.54 v33.95,75.65 | IC1.16 34.71,73.78
  Top 0.508: U1.1 48.5,34.88 v48.5,38.06 v48.51,38.06 | IC2.3 IC2.4 29.32,39.16 29.32,38.14 28.74,37.56 v28.74,37.44 | D4.2 13.85,67.28 v13.89,67.31 | R6.2 66.69,60.67 66.29,61.07 | 66.29,61.07 62.9,61.07 v62.46,61.51 | R5.2 66.77,61.07 66.29,61.07
  Bottom 0.254: v17.38,80.05 17.38,67.07 v17.63,66.83
  pour Route15 (isolate 0.254, rank 2): 0,0.05 0,99.55 78.95,99.58 79.07,99.46 79.07,0.11 79,0.05
5V  (via drill 0.35 pad 0.78)
  Top 0.508: 5V.1 72.7,39.36 FB1.1 | J1.10 39.65,89.69 v39,89.05 | J1.2 47.65,89.15 v48.11,88.68 | J2.10 58.44,90.38 v55.8,90.38 | J2.2 v67.73,88.38 | J3.10 68.33,83.92 v67.71,84.54 | J3.2 69.82,75.92 69,75.09 69,71.75 v69.25,71.49
  Bottom 0.508: B1.4 20.59,40.27 20.59,49.92 21.95,51.28 38.02,51.28 48.12,41.17 5V.1
  pour Route15 (isolate 0.254): 79,39.05 65,39.05 65,87.05 32.98,87.05 32.98,99.53 79,99.53 79.02,99.5 79.02,39.07
5V_O
  Top 0.254: PAD2.1
  Top 0.381: U2.4 7.56,83.3 TP1.TP-5
  Top 0.508: PAD2.1 PAD1.1 7.53,91.69 C12.1 | PAD2.1 3.7,84.99 TP1.TP-5
5VIN  (via drill 0.35 pad 0.78)
  Top 0.254: 11.02,85.8 C11.1 | D2.1 | 61.21,36.54 C2.1 | 56.02,43.32 U1.3
  Top 0.508: U2.3 11.02,83.05 | 11.02,83.05 11.02,85.8 | D2.1 D1.1 56.02,43.32 | D2.1 61.21,36.54 | U1.3 52.7,42.77 v49.13,42.77 | v10,84.05 11,83.05 11.02,83.05
  Bottom 0.508: v49.13,42.77 48.08,42.77 37.98,52.87 21.72,52.87 17.05,48.2 14.36,48.2 8.66,53.91 8.66,82.7 v10,84.05
A1
  Top 0.254: IC1.136 42.43,84.53 41.96,85 41.65,85.32 40.65,86.32 J1.9
A2
  Top 0.254: IC1.133 43.93,86.76 42.82,87.87 42.65,88.05 41.65,89.05 J1.8
A3
  Top 0.254: IC1.132 44.43,87.67 44.03,88.07 43.65,88.45 42.65,89.45 J1.7
A4
  Top 0.254: IC1.131 44.92,88.11 43.65,89.39 J1.6
A5
  Top 0.254: IC1.130 45.43,88.43 44.65,89.21 J1.5
A6
  Top 0.254: IC1.129 45.93,89.21 45.65,89.5 J1.4
A7
  Top 0.254: IC1.128 46.43,86.79 46.61,86.97 46.61,91.49 J1.3
B1
  Top 0.254: IC1.127 46.94,84.05 49.46,86.57 52.9,86.57 55.55,89.22 59.36,89.22 60.73,90.59 J2.9
B2
  Top 0.254: IC1.116 52.43,85.27 55.72,88.56 60,88.56 61.73,90.29 J2.8
B3
  Top 0.254: IC1.115 52.93,84.91 56.1,88.07 60.66,88.07 62.73,90.15 J2.7
B4
  Top 0.254: IC1.114 53.43,84.5 56.47,87.54 61.21,87.54 63.73,90.05 J2.6
B5
  Top 0.254: IC1.113 53.93,84.08 56.83,86.98 61.46,86.98 64.74,90.27 64.74,91.65 J2.5
B6
  Top 0.254: IC1.109 55.93,84.55 57.88,86.5 62.2,86.5 65.74,90.04 J2.4
B7
  Top 0.254: IC1.106 58.87,80.28 66.72,88.13 66.72,91.66 J2.3
C1
  Top 0.254: IC1.105 62.85,79.78 65.99,82.92 J3.9
C2
  Top 0.254: IC1.104 63.31,79.28 65.95,81.92 J3.8
C3
  Top 0.254: IC1.98 61.56,76.28 65.17,79.88 65.2,79.92 66.2,80.92 J3.7
C4
  Top 0.254: IC1.97 62.81,75.78 66.95,79.92 J3.6
C5
  Top 0.254: IC1.82 65.78,68.28 66.9,69.39 66.9,76.25 69.61,78.96 70.97,78.96 J3.5
C6
  Top 0.254: IC1.81 66.02,67.78 67.59,69.35 67.59,75.97 69.52,77.9 70.99,77.9 J3.4
C7  (via drill 0.35)
  Top 0.254: IC1.65 52.43,60.13 52.29,59.98 52.29,52.34 v52.27,52.34 | v69.52,65.99 68.22,67.28 68.22,75.67 69.47,76.92 J3.3
  Bottom 0.254: v52.27,52.34 52.27,50.02 54.08,48.21 70.76,48.21 73.89,51.35 73.89,61.61 v69.52,65.99
CTS
  Top 0.254: B1.7 21.91,33.96 35.64,33.96 48.08,46.39 48.08,59.63 47.43,60.28 IC1.55
GND  (via drill 0.35 pad 0.78, 0.45, 0.45 pad 0.78, 0.48 pad 0.78, 1)
  Top 0.254: C6.2 24.6,78.16 C5.2 24.67,78.17 C4.2 31.17,78.07 C3.2 | S1.4 S1.3 | U$1.5 25.92,93.87 25.93,93.86
  Top 0.508: v8.5,98.15 8.39,98.03 C12.2 | C11.2 11.67,89.55 R4.1 15.16,93.24 v15.2,93.28 | 25.93,93.86 25.07,92.99 21.99,92.99 v21.97,93 | v19.45,78.35 19.64,78.16 C6.2 31.21,78.16 C3.2 33.66,78.13 v33.84,78.3 | U2.2 11.97,83.76 v12.3,84.09 | C10.2 16.79,51.08 v16.74,51.03 | S1.3 5.51,47.74 5.51,49.68 v5.54,49.71 | S1.4 5.56,39.62 5.59,39.49 v5.5,39.4 | B1.2 5.83,33.41 v5.88,33.46 | IC2.5 30.98,39.18 | C1.2 44.48,37.96 44.49,37.99 v44.36,38.12 | U1.2 58.13,33.13 v58.13,33.11 59.03,32.2 SV2.3 | FB3.1 29.39,57.04 v29.42,57.02 | TP1.TP-2 TP1.TP-1 5.38,72.76 v3.63,71 | J1.1 48.65,90.6 v49.59,89.66 | J2.1 68.73,89.81 v69.04,89.5 | J3.1 70.23,74.13 v70.23,73.52
  Top 0.762: IC2.6 30.98,39.22 30.98,39.18 30.98,37.47 v30.95,37.44
  Top 1.016: C2.2 69.99,35.79 v70.05,35.73 73.47,35.73 GND.1
  pour Top: 25.44,40.06 26.49,40.06 26.54,40.01 26.54,38.9 26.48,38.84 25.45,38.84 25.38,38.91 25.38,40.04 25.4,40.06
  pour Route2 (isolate 0.254, rank 2): 0,0.05 -0.03,99.55 79,99.55 79.03,99.51 79.03,0.08 79,0.05
GND_CRSTL  (via drill 0.45)
  Top 0.45: Y1.4 61.81,52.55 v61.86,52.51 | Y1.2 58.11,59.41 v58.14,59.43
  pour Route2 (isolate 0.508): 55.42,60.28 63.62,60.28 63.62,50.9 55.42,50.9
GND_CRSTL2
  pour Route2 (isolate 0.508): 42,60.05 42,55.05 31,55.05 31,60.05
MODE
  Top 0.254: B1.8 23.69,33.2 36.04,33.2 52.93,50.09 52.93,50.11 52.93,50.12 IC1.66
N$5
  Top 0.254: C10.1 13.85,59.6 D4.1 D3.1 19.55,59.42 C10.1 | C10.1 25.05,56.66 27.08,54.63 42.03,54.63 42.77,55.37 42.77,58.66 40.93,60.49 IC1.42
N$8
  Top 0.292: U$1.2 27.85,94.7 27.85,90.78 28.47,90.16 R1.1
N$10
  Top 0.292: U$1.3 27.22,90.9 R2.1
N$21
  Top 0.254: FB1.2 68.52,39.26 | D2.2
  Top 0.508: 68.52,39.26 D2.2 | D2.2 D1.2
N$23
  Top 0.254: Y1.1 61.81,60.71 58.75,63.78 IC1.73
N$24
  Top 0.254: 29.43,64.68 C7.1 | 33,65.78 IC1.32
  Top 0.292: 33,65.78 31.56,67.21 R3.2 31.56,66.81 29.43,64.68
N$26
  Top 0.254: C9.2 25.5,59.68 25.5,61.05 25.5,65.9 C8.2 | IC1.33 36.44,65.02 | 36.44,65.02 IC1.34 | C9.2 25.48,59.13 26.63,57.97 FB3.2 | C7.2 27.07,61.27 | 36.44,65.02 34.4,65.02 30.66,61.27 27.07,61.27 | C9.2 27.04,61.27 27.07,61.27
N$27  (via drill 0.35)
  Top 0.254: v24.11,71.93 C8.1 27.72,72.01 | 33.28,70.05 33.28,67.43 34.43,66.28 IC1.31 | v18.19,78.47 18.19,79.69 FB2.1
  Top 0.292: 27.72,72.01 27.75,72.05 30.36,72.05 R3.1 32.49,70.84 33.28,70.05
  Bottom 0.254: v18.19,78.47 18.19,75.11 21.3,72 24.04,72 v24.11,71.93
N$28
  Top 0.254: IC1.37 37.6,60.96 31.35,60.96 30.1,59.71 C9.1
N$29
  Top 0.254: IC1.72 55.93,57.56 Y1.3
N$30
  Top 0.254: IC1.40 39.93,60.95 38.7,59.72 38.7,58.51 40,57.21 X1.1
N$31
  Top 0.254: IC1.41 40.43,58.58 X1.2
N$34
  Top 0.254: R4.2 12.92,83.28 U2.1 14.31,80.68 14.31,78.35 16.25,76.42 33.65,76.42 34.5,77.28 IC1.9
PRGM
  Top 0.254: S1.2 S1.1 10.49,49.51 31.22,49.51 32.16,48.57 IC2.18
  Top 0.508: S1.2 9.2,38.17 9.16,37.86 PRGM.1
PTA6
  Top 0.254: IC2.10 36.78,41.83 45.43,50.48 IC1.51
PTA7  (via drill 0.35, 0.35 pad 0.78)
  Top 0.254: IC2.15 38.73,45.83 44.13,51.23 v44.15,51.23 | v47.03,58.77 47.03,59.52 46.43,60.12 IC1.53
  Bottom 0.254: v44.15,51.23 45.94,51.23 47.01,52.31 47.01,58.75 v47.03,58.77
PTB0
  Top 0.254: IC1.50 44.93,53.65 37.9,46.63 IC2.16
PTB1  (via drill 0.35, 0.35 pad 0.78)
  Top 0.254: IC2.17 38.16,48.05 44.12,54.01 44.12,56.05 v44.12,57.12 | v46.23,57.11 45.93,57.41 IC1.52
  Bottom 0.254: v44.12,57.12 46.21,57.12 v46.23,57.11
RESET  (via drill 0.35)
  Top 0.254: IC2.25 24.72,46.63 23,44.91 23,37.9 | 23,37.9 24.63,36.27 33.15,36.27 34.09,37.21 | v77.37,56.61 77.37,59.92 76.75,60.55 71.74,60.55 68.01,64.28 IC1.74 | 34.09,37.21 v34.12,37.24 | IC2.8 32.96,38.34 34.09,37.21 | RST.1 23,37.9
  Bottom 0.254: v34.12,37.24 36.09,37.24 45.91,27.41 71.09,27.41 77.37,33.7 v77.37,56.61
RTS
  Top 0.254: B1.3 10.48,28.47 33.08,28.47 53.41,48.8 53.41,60.91 53.43,60.92 IC1.67
RX1  (via drill 0.35 pad 0.78)
  Top 0.254: v45.57,47.31 33.69,35.44 18.3,35.44 B1.5 11.67,32.36 RX1.1 | v62.88,75.06 62.66,75.28 IC1.96
  Bottom 0.254: v45.57,47.31 71.96,47.31 74.87,50.23 74.87,61.84 62.88,73.83 v62.88,75.06
SCL0  (via drill 0.35, 0.35 pad 0.78)
  Top 0.254: R5.1 70.45,49.5 v70.47,49.47 74.13,49.47 77.9,45.7 77.9,32.32 75.6,30.02 SV2.1 | IC1.84 58.74,69.28 59.51,70.05 v63.94,70.05 | v63.94,70.05
  Bottom 0.254: v70.47,49.47 70.97,49.47 72.21,50.72 72.21,62.02 68.61,65.61 | v63.94,70.05 64.18,70.05 68.61,65.61 | 68.61,65.61 SCL0.1
SDA0  (via drill 0.35)
  Top 0.254: R6.1 66.66,52.13 v66.66,50 71.18,45.48 76.25,45.48 77.17,44.56 77.17,32.86 76.51,32.2 63.83,32.2 SV2.2 | v63.59,69.11 59.27,69.11 58.91,68.76 57.94,68.76 IC1.83
  Bottom 0.254: v66.66,50 66.66,50.46 64.86,52.26 64.86,63.05 | 64.86,63.05 64.86,68.64 64.43,69.06 63.64,69.06 v63.59,69.11 | 64.86,63.05 62.89,65.01 SDA0.1
TX1  (via drill 0.35 pad 0.78)
  Top 0.254: B1.6 20.19,34.79 35.06,34.79 46.42,46.15 v46.44,46.15 | v64.27,73.95 v64.27,73.96 62.47,73.96 61.65,74.78 IC1.95
  Bottom 0.254: v46.44,46.15 72.71,46.15 75.81,49.25 75.81,63.19 65.05,73.95 v64.27,73.95 | B1.6 15.99,31.84 20.03,35.88 TX1.1
USB0_D_N
  Top 0.292: R1.2 28.23,86.57 28.23,84.26 28.54,83.96 35.88,83.96 38.41,81.43 38.41,72.52 37.66,71.77 IC1.20
USB0_D_P
  Top 0.292: R2.2 27.79,86.13 27.79,84.08 28.35,83.52 35.69,83.52 37.96,81.25 37.96,72.71 37.54,72.28 37,72.28 36.99,72.28 IC1.19 36.01,72.28
USB1_D_N
  Top 0.292: IC1.26 34.96,68.78 34.16,69.58 34.16,72.34 32.24,74.26 17.98,74.26 10.93,67.2 3.68,67.2 1.77,69.11 1.77,78.22 3.23,79.69 4.32,79.69 TP1.TP-4 5.69,80.76 6.88,79.57 7.92,79.57 10,77.49 11.39,77.49 11.99,78.1 11.98,78.12 U2.5
USB1_D_P
  Top 0.292: IC1.25 36,69.28 35.09,69.28 34.61,69.76 34.61,72.51 32.42,74.7 17.8,74.7 10.74,67.64 3.86,67.64 2.21,69.3 2.21,78.04 3.42,79.25 4.36,79.25 TP1.TP-3 5.97,78.22 6.88,79.13 7.74,79.13 9.82,77.05 11.75,77.05 12.89,78.19 12.89,79.81 U2.6